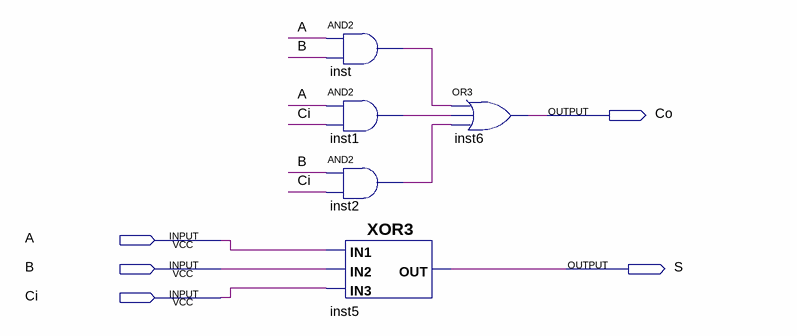
[diagram p0: schematic sheet]
// Quartus schematic Sumador1bit.bdf as structural Verilog: 5 symbols, 5 pins
module Sumador1bit (
  input  A,
  input  B,
  input  Ci,
  output Co,
  output S
);

  wire inst1_out, inst2_out, inst_out;

  and inst (inst_out, A, B);
  and inst1 (inst1_out, A, Ci);
  and inst2 (inst2_out, B, Ci);
  XOR3 inst5 (.IN3(Ci), .IN1(A), .IN2(B), .OUT(S));
  or inst6 (Co, inst_out, inst1_out, inst2_out);
endmodule
